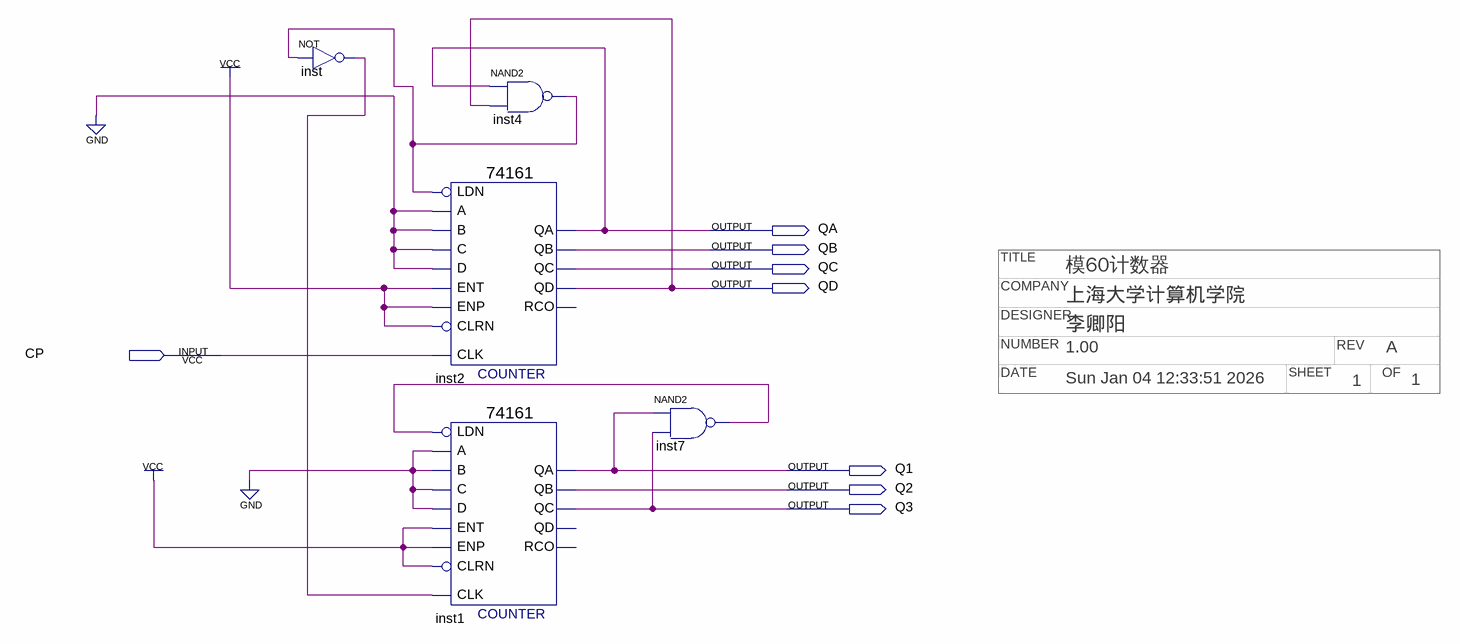
[diagram p0: schematic sheet]
// Quartus schematic w72.bdf as structural Verilog: 5 symbols, 8 pins
// Title block: TITLE: 模60计数器; COMPANY: 上海大学计算机学院; DESIGNER: 李卿阳; NUMBER: 1.00; REV: A; DATE: Sun Jan 04 12:33:51 2026; SHEET: 1; OF: 1
module w72 (
  input  CP,
  output QA,
  output QB,
  output QC,
  output QD,
  output Q1,
  output Q2,
  output Q3
);

  wire inst4_out, inst7_out, inst_out;

  not inst (inst_out, inst4_out);
  \74161  inst2 (
    .CLRN(1'b1), .CLK(CP), .ENP(1'b1), .LDN(inst4_out), .A(1'b0), .D(1'b0), .ENT(1'b1), .B(1'b0), .C(1'b0),
    .QD(QD), .QC(QC), .QB(QB), .QA(QA));  // open: RCO
  \74161  inst1 (
    .CLRN(1'b1), .CLK(inst_out), .ENP(1'b1), .LDN(inst7_out), .A(1'b0), .D(1'b0), .ENT(1'b1), .B(1'b0),
    .C(1'b0), .QC(Q3), .QB(Q2), .QA(Q1));  // open: QD, RCO
  nand inst4 (inst4_out, QA, QD);
  nand inst7 (inst7_out, Q1, Q3);
endmodule
